# EAGLE design FridgeWarninig_0.3 (EAGLE 7.0.0)
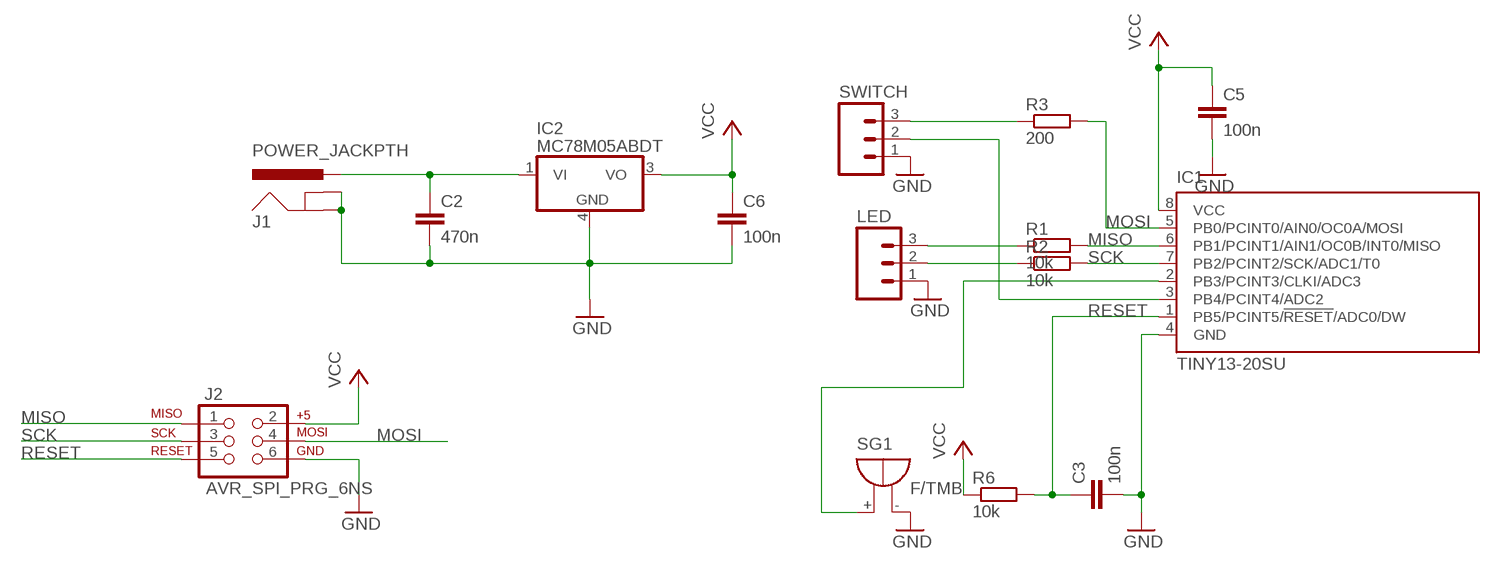
[diagram p0: schematic, sheet 1]

## Parts
C2  470n  C-EUC0603  [C0603]
C3  100n  C-EUC0603  [C0603]
C5  100n  C-EUC0603  [C0603]
C6  100n  C-EUC0603  [C0603]
IC1  TINY13-20SU  [8S2]
IC2  MC78M05ABDT  [DPACK_3]
J1  POWER_JACKPTH  [POWER_JACK_PTH]
J2  AVR_SPI_PRG_6NS  [2X3-NS]
LED  M03JST-PTH  [JST-3-PTH]
R1  10k  R-EU_R0603  [R0603]
R2  10k  R-EU_R0603  [R0603]
R3  200  R-EU_R0603  [R0603]
R6  10k  R-EU_R0603  [R0603]
SG1  F/TMB  [F/TMB]
SWITCH  M03JST-PTH  [JST-3-PTH]

## Nets
GND: C2.2 C3.2 C5.2 C6.2 IC1.4(GND) IC2.4(GND) J1.GND J1.GNDBREAK J2.6 LED.1 SG1.- SWITCH.1
MISO: IC1.6(PB1/PCINT1/AIN1/OC0B/INT0/MISO) J2.1 R1.2
MOSI: IC1.5(PB0/PCINT0/AIN0/OC0A/MOSI) J2.4 R3.2
N$2: C2.1 IC2.1(VI) J1.PWR
N$5: IC1.2(PB3/PCINT3/CLKI/ADC3) SG1.+
N$6: LED.2 R2.1
N$7: R3.1 SWITCH.3
N$8: LED.3 R1.1
N$9: IC1.3(PB4/PCINT4/ADC2) SWITCH.2
RESET: C3.1 IC1.1(PB5/PCINT5/!RESET!/ADC0/DW) J2.5 R6.2
SCK: IC1.7(PB2/PCINT2/SCK/ADC1/T0) J2.3 R2.2
VCC: C5.1 C6.1 IC1.8(VCC) IC2.3(VO) J2.2 R6.1

## Library data of the parts
C2 C3 C5 C6 = resistor:C-EU: CAPACITOR, European symbol
IC1 = atmel:TINY13: 8-bit AVR Microcontroller with 1K Bytes In-System Programmable Flash Source: http://www.atmel.com/dyn/resources/prod_documents/2535S.pdf; MPN: ATTINY13-20SU; OC_FARNELL: 9171568; OC_NEWARK: 96K6522
IC2 = linear:MC78M: 500 mA Positive Voltage Regulators Source: Data sheet <http://www.onsemi.com/pub_link/Collateral/MC78M00-D.PDF>
J1 = SparkFun-Connectors:POWER_JACK: Power Jack This is the standard 5.5mm barrel jack for power. The PTH is the most common, proven, reliable, footprint. The Slot footprint only works if the mill layer is transmitted to the PCB fab house so be warned. Mating wall wart : TOL-00298 (and others); PROD_ID: PRT-00119
J2 = SparkFun-Connectors:AVR_SPI_PRG_6: AVR ISP 6 Pin This is the reduced ISP connector for AVR programming. Common on Arduino. This footprint will take up less PCB space and can be used with a 10-pin to 6-pin adapter such as SKU: BOB-08508 **Special note about "TEST_POINT" package. The stop mask is on the top side, so if you want your programming test points to be on the bottom of your board, make sure to place this package on the bottom side of the board. This also ensure that the orientation to program from the bottom side will be correct.
LED SWITCH = SparkFun-Connectors:M03: Header 3 Standard 3-pin 0.1" header. Use with straight break away headers (SKU : PRT-00116), right angle break away headers (PRT-00553), swiss pins (PRT-00743), machine pins (PRT-00117), and female headers (PRT-00115). Molex polarized connector foot print use with SKU : PRT-08232 with associated crimp pins and housings.; SKU: PRT-09915
R1-R3 R6 = resistor:R-EU_: RESISTOR, European symbol
SG1 = buzzer:F/TMB: BUZZER Source: Buerklin; OC_FARNELL: unknown; OC_NEWARK: unknown

## Board
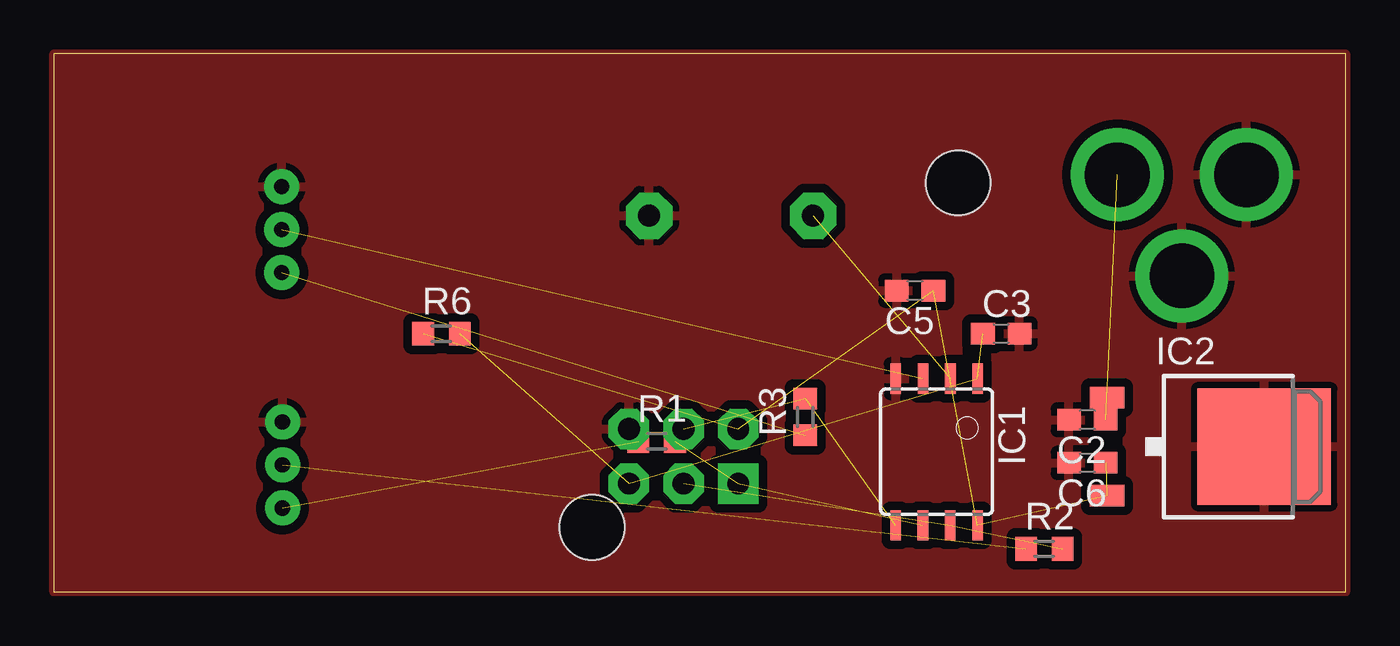
[diagram p1: board, top side]
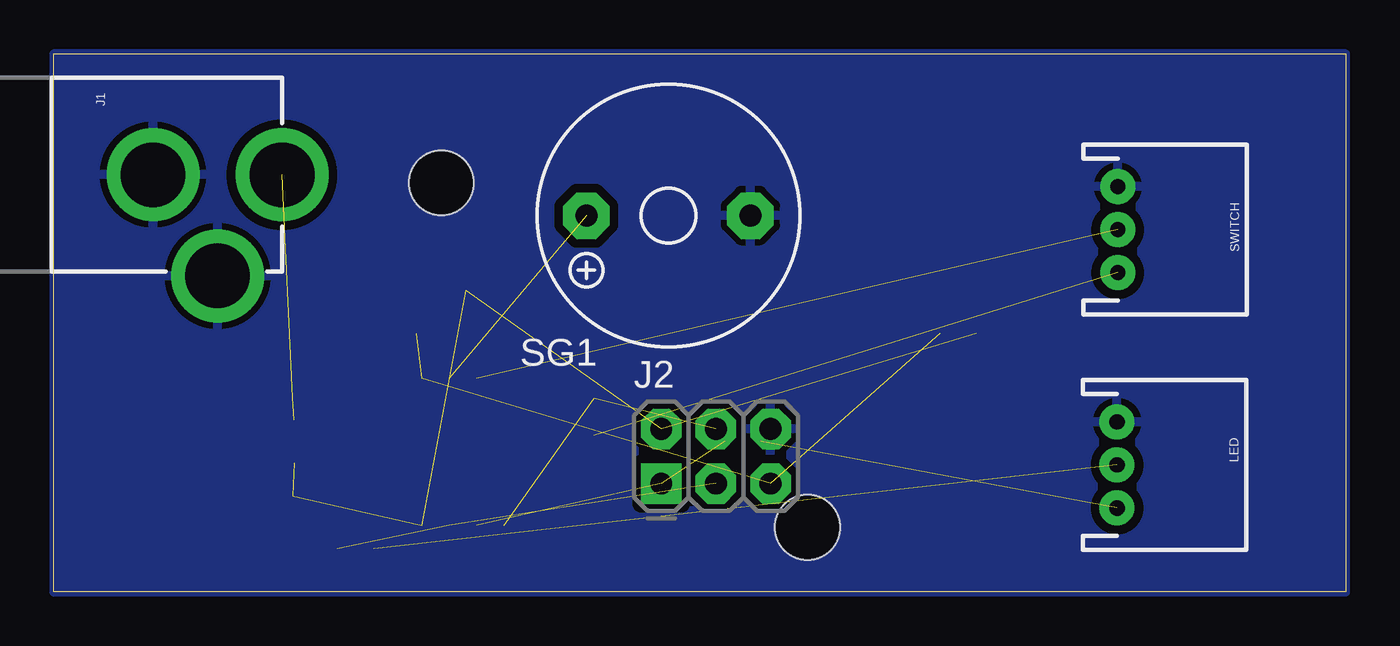
[diagram p2: board, bottom side, seen from below]

Size 60 x 25 mm. Coordinates in mm from the lower left corner, seen from the top.
Outline: 0,0 60,0 60,25 0,25 0,0
Copper layers (1*16): Top 0.035mm / dielectric 1.5mm / Bottom 0.035mm
Design rules "FridgeWarninig_0.1": minimum track width 8mil, minimum drill 0.4mm, track to track 16mil, track to pad 12mil, pad to pad 8mil, via to via 10mil, smd to smd 8mil, copper to edge 0mil, drill to drill 8mil, minimum pad ring 10mil, minimum via ring 12mil, stop-mask expansion 4mil, vias tented up to drill 0mil, thermal gap 12mil
Holes 3 mm at 25,3 42,19

### Footprints (pad centres in the part's own frame; a part is rotated, then mirrored left to right if it is on the bottom)
C0603 = smd 1.1 x 1: 1 -0.85,0; 2 0.85,0
8S2 = smd 0.5 x 1.4: 1 -1.905,-3.404; 2 -0.645,-3.404; 3 0.625,-3.404; 4 1.895,-3.404; 5 1.905,3.404; 6 0.635,3.404; 7 -0.635,3.404; 8 -1.905,3.404
DPACK_3 = smd 1 x 1.6: 1 -2.28,-4.8; 3 2.28,-4.8 | smd 5.4 x 6.2: 4 0,2.5
POWER_JACK_PTH = drill 2.997 pad 4.318: GND 0,7.7; GNDBREAK 4.7,10.7; PWR 0,13.7
2X3-NS = drill 1.016 pad 1.88 square: 1 -2.54,-1.27 | drill 1.016 pad 1.88 octagon: 2 -2.54,1.27; 3 0,-1.27; 4 0,1.27; 5 2.54,-1.27; 6 2.54,1.27
JST-3-PTH = drill 0.7 pad 1.626: 1 -2,0; 2 0,0; 3 2,0
R0603 = smd 1 x 1.1: 1 -0.85,0; 2 0.85,0
F/TMB = drill 1.016 pad 2.159 octagon: + 3.81,0; - -3.81,0

### Placement (x,y rotation side)
C2  48,8 180 top
C3  44,12 0 top
C5  40,14 180 top
C6  48,6 180 top
IC1  41,6.5 180 top
IC2  53.71,6.75 270 top
J1  63.1,19.38 270 bottom
J2  29.25,6.3 0 bottom
LED  10.62,5.89 270 bottom
R1  28,7 0 top
R2  46,2 0 top
R3  34.9,8.13 90 top
R6  18,12 0 top
SG1  31.46,17.48 180 bottom
SWITCH  10.58,16.83 270 bottom

### Tracks (layer width: path | path; a pad name or v marks a point on that pad's centre or on a via)
GND
  pour Top: 0,0 0,25 60,25 60,0
  pour Bottom: 0,0 0,25 60,25 60,0
MISO  (2 unrouted)
MOSI  (2 unrouted)
N$2  (2 unrouted)
N$3
  pour Top: 0,0 0,25 60,25 60,0
N$5  (1 unrouted)
N$6  (1 unrouted)
N$7  (1 unrouted)
N$8  (1 unrouted)
N$9  (1 unrouted)
RESET  (3 unrouted)
SCK  (2 unrouted)
VCC  (5 unrouted)